# Altium schematic sheet Analogue_frontend.SchDoc
size A4
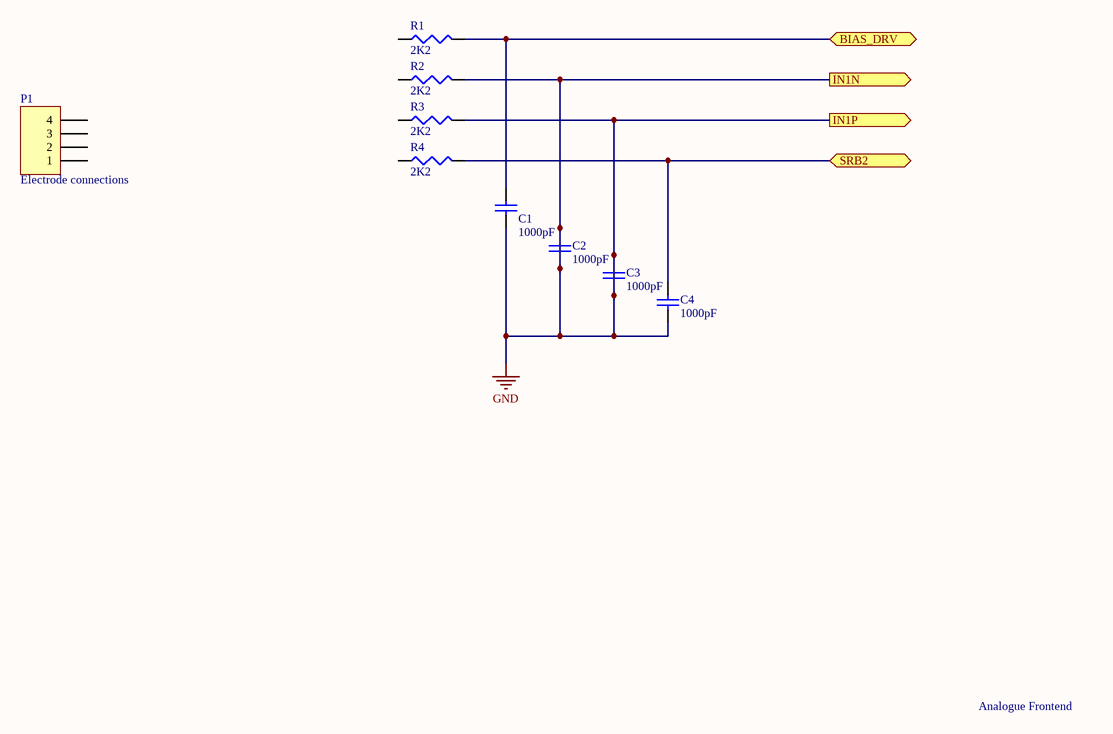
[diagram p0: Analogue_frontend.SchDoc]

## Parts
C1  value 1000pF  [1608[0603]]  (hidden comment: Cap Semi)
C2  value 1000pF  [1608[0603]]  (hidden comment: Cap Semi)
C3  value 1000pF  [1608[0603]]  (hidden comment: Cap Semi)
C4  value 1000pF  [1608[0603]]  (hidden comment: Cap Semi)
P1  Electrode connections  [HDR1X4]
R1  value 2K2  [J1-0603]  (hidden comment: Res3)
R2  value 2K2  [J1-0603]  (hidden comment: Res3)
R3  value 2K2  [J1-0603]  (hidden comment: Res3)
R4  value 2K2  [J1-0603]  (hidden comment: Res3)

## Ports
BIAS_DRV (bidir), IN1N (out), IN1P (out), SRB2 (bidir)

## Nets
GND: C1.1 C2.1 C2.2 C3.1 C3.2 C4.1 R2.2 R3.2 ; port IN1N, port IN1P
BIAS_DRV: C1.2 R1.2 ; port BIAS_DRV
SRB2: C4.2 R4.2 ; port SRB2

Not connected (* = marked no-connect by the designer): P1 1 2 3 4; R1 1; R2 1; R3 1; R4 1

## Notes on the sheet
- Analogue Frontend

## Library data of the parts
C1-C4 = Cap Semi: Capacitor (Semiconductor SIM Model); Published: 8-Jun-2000; LatestRevisionDate: 29-May-2009; LatestRevisionNote: IPC-7351 Footprint Added.; PackageReference: C1206; Publisher: Altium Limited; PackageDescription: Chip Capacitor
P1 = Header 4: Header, 4-Pin; LatestRevisionDate: 17-Jul-2002; LatestRevisionNote: Re-released for DXP Platform.; Publisher: Altium Limited
R1-R4 = Res3: Resistor; Published: 8-Jun-2000; LatestRevisionDate: 29-May-2009; LatestRevisionNote: IPC-7351 Footprint Added.; PackageReference: J1-0603; Publisher: Altium Limited; PackageDescription: Chip Resistor